# EAGLE design board (EAGLE 9.3.0)
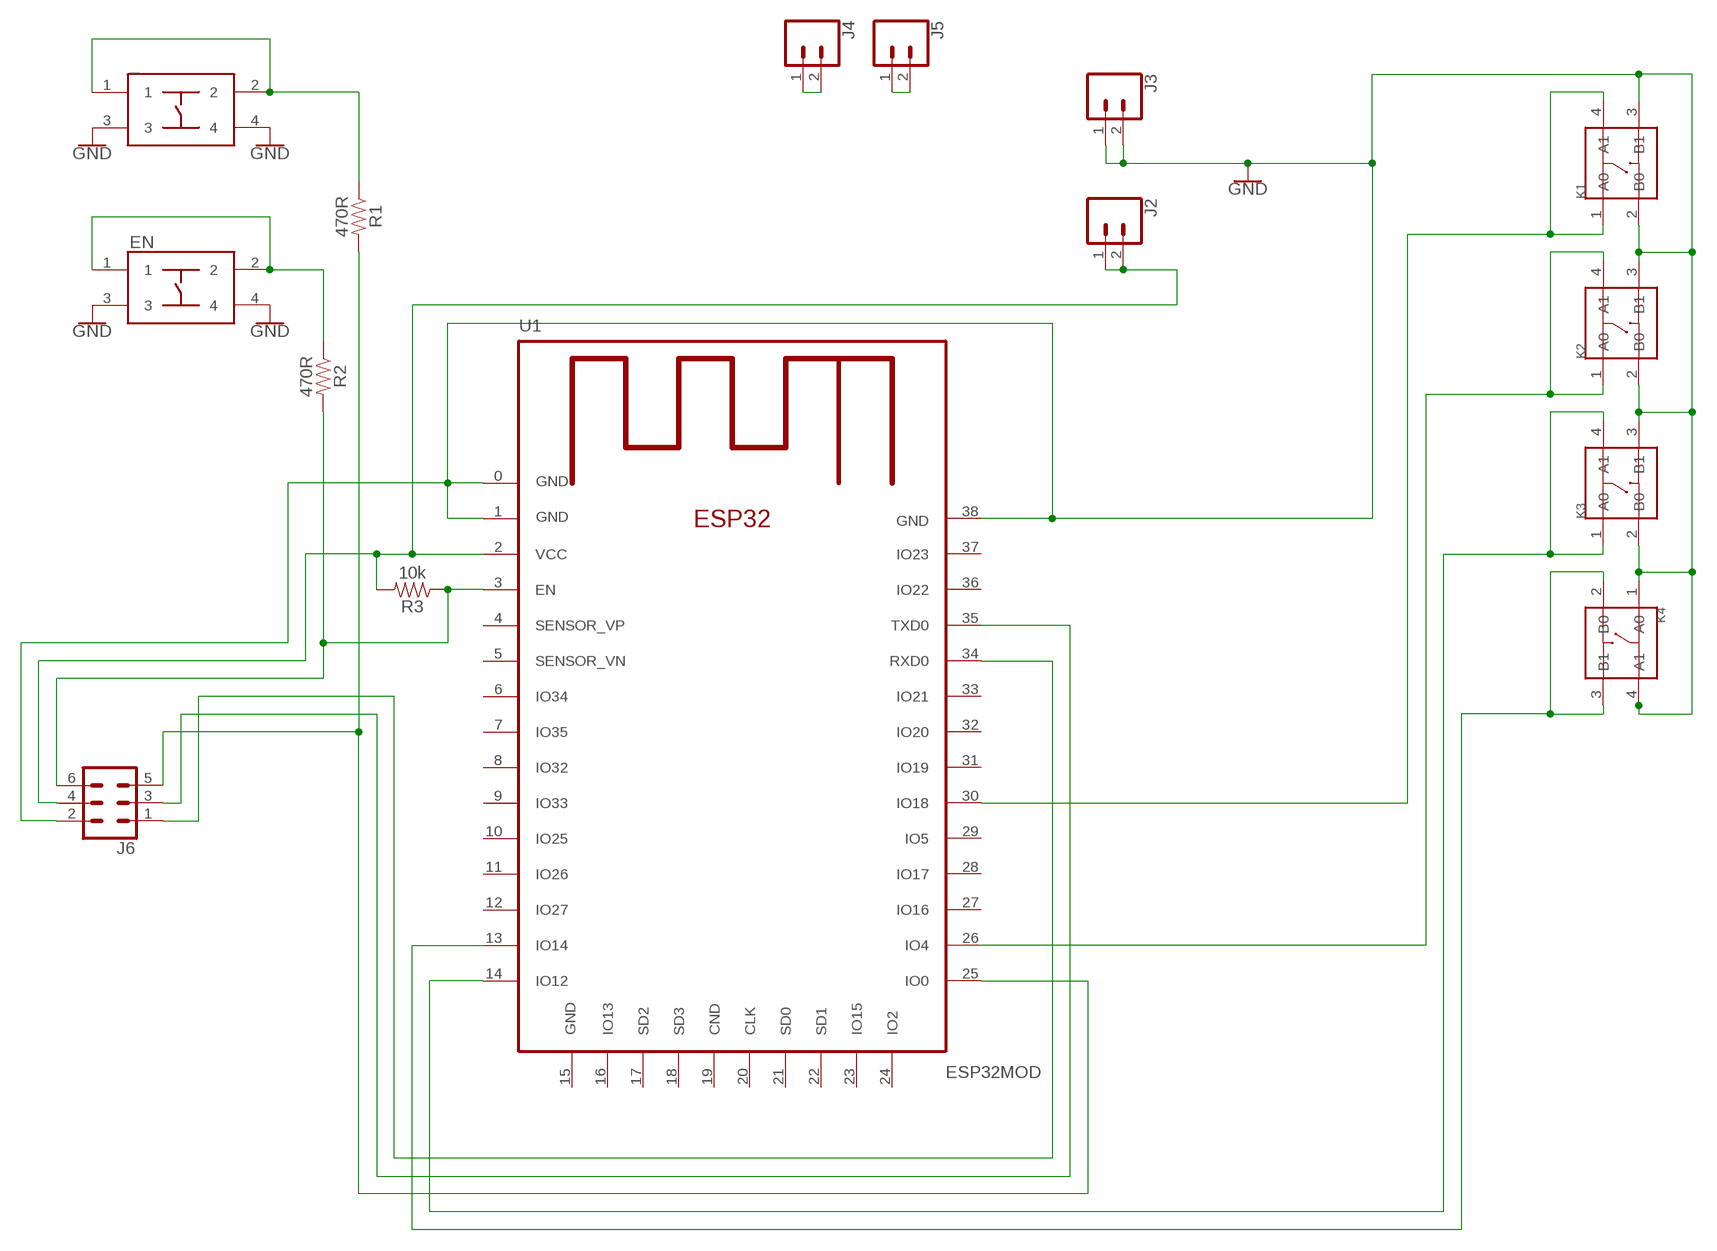
[diagram p0: schematic, sheet 1]

## Parts
_  TACTILE_SWITCH_DEV  [TACTEIL_SWITCH_PAC]
EN  TACTILE_SWITCH_DEV  [TACTEIL_SWITCH_PAC]
J2  CONN_02  [1X02]
J3  CONN_02  [1X02]
J4  CONN_02  [1X02]
J5  CONN_02  [1X02]
J6  CONN_03X2FEMALE_SMD  [2X3_SMD]
K1  SMD-SWITCH-TACTILE-SPST-NO(4P-D6.0MM)  [SW4-SMD-6.0X6.0X5.0MM]
K2  SMD-SWITCH-TACTILE-SPST-NO(4P-D6.0MM)  [SW4-SMD-6.0X6.0X5.0MM]
K3  SMD-SWITCH-TACTILE-SPST-NO(4P-D6.0MM)  [SW4-SMD-6.0X6.0X5.0MM]
K4  SMD-SWITCH-TACTILE-SPST-NO(4P-D6.0MM)  [SW4-SMD-6.0X6.0X5.0MM]
R1  470R  1KOHM-0603-1/10W-1%  [0603]
R2  470R  1KOHM-0603-1/10W-1%  [0603]
R3  10k  1KOHM-0603-1/10W-1%  [0603]
U1  ESP32MOD  [ESP32MOD]

## Nets
GND: _.3 _.4 EN.3 EN.4 J3.1 J3.2 J6.2 K1.2(B0) K1.3(B1) K2.2(B0) K2.3(B1) K3.2(B0) K3.3(B1) K4.1(A0) K4.4(A1) U1.0(GND) U1.1(GND) U1.38(GND)
N$1: _.1 _.2 R1.1
N$2: J6.6 R2.2 R3.1 U1.3(EN)
N$4: J2.1 J2.2 J6.4 R3.2 U1.2(VCC)
N$7: EN.1 EN.2 R2.1
N$9: J4.1 J4.2
N$10: J6.5 R1.2 U1.25(IO0)
N$11: K2.1(A0) K2.4(A1) U1.26(IO4)
N$12: K3.1(A0) K3.4(A1) U1.14(IO12)
N$13: K4.2(B0) K4.3(B1) U1.13(IO14)
N$14: J5.1 J5.2
N$15: K1.1(A0) K1.4(A1) U1.30(IO18)
N$16: J6.3 U1.35(TXD0)
N$17: J6.1 U1.34(RXD0)
Unconnected: U1.4(SENSOR_VP) U1.5(SENSOR_VN) U1.6(IO34) U1.7(IO35) U1.8(IO32) U1.9(IO33) U1.10(IO25) U1.11(IO26) U1.12(IO27) U1.16(IO13) U1.17(SD2) U1.18(SD3) U1.19(CND) U1.20(CLK) U1.21(SD0) U1.22(SD1) U1.23(IO15) U1.24(IO2) U1.27(IO16) U1.28(IO17) U1.29(IO5) U1.31(IO19) U1.32(IO20) U1.33(IO21) U1.36(IO22) U1.37(IO23)

## Power pins joined to a net without a drawn wire
GND: U1.15(GND)

## Library data of the parts
_ EN = Tactaile:TACTILE_SWITCH_DEV
J2-J5 = SparkFun-Connectors:CONN_02: Multi connection point. Often used as Generic Header-pin footprint for 0.1 inch spaced/style header connections On any of the 0.1 inch spaced packages, you can populate with these: Break Away Headers - Straight <https://www.sparkfun.com/products/116> (PRT-00116) Break Away Male Headers - Right Angle <https://www.sparkfun.com/products/553> (PRT-00553) Female Headers <https://www.sparkfun.com/products/115> (PRT-00115) Break Away Headers - Machine Pin <https://www.sparkfun.com/products/117> (PRT-00117) Break Away Female Headers - Swiss Machine Pin <https://www.sparkfun.com/products/743> (PRT-00743) For SCREWTERMINALS and SPRING TERMINALS visit here: Screw Terimnals on SparkFun.com <https://www.sparkfun.com/search/results?term=Screw+Terminals> (5mm/3.5mm/2.54mm spacing) This device is also useful as a general connection point to wire up your design to another part of your project. Our various solder wires solder well into these plated through hole pads. Hook-Up Wire - Assortment (Stranded, 22 AWG) <https://www.sparkfun.com/products/11375> (PRT-11375) Hook-Up Wire - Assortment (Solid Core, 22 AWG) <https://www.sparkfun.com/products/11367> (PRT-11367) View the entire wire category on our website here <https://www.sparkfun.com/categories/141> Special notes: Molex polarized connector foot print use with: PRT-08233 with associated crimp pins and housings. 2.54_SCREWTERM for use with PRT-10571. 3.5mm Screw Terminal footprints for PRT-08084 5mm Screw Terminal footprints for use with PRT-08432
J6 = SparkFun-Connectors:CONN_03X2: Multi connection point. Often used as Generic Header-pin footprint for 0.1 inch spaced/style header connections You can populate with any combo of single row headers, but if you'd like an exact match, check these: Header - 2x3 (Male, 0.1") <https://www.sparkfun.com/products/12807> (PRT-12807) Header - 2x3 (Female, 0.1") <https://www.sparkfun.com/products/13010> (PRT-13010) 2x3 Pin Shrouded Header <https://www.sparkfun.com/products/10877> (PRT-10877) On any of the 0.1 inch spaced packages, you can populate with these: Break Away Headers - Straight <https://www.sparkfun.com/products/116> (PRT-00116) Break Away Male Headers - Right Angle <https://www.sparkfun.com/products/553> (PRT-00553) Female Headers <https://www.sparkfun.com/products/115> (PRT-00115) Break Away Headers - Machine Pin <https://www.sparkfun.com/products/117> (PRT-00117) Break Away Female Headers - Swiss Machine Pin <https://www.sparkfun.com/products/743> (PRT-00743) Special note: the shrouded connector mates well with our 3x2 ribbon cables: Ribbon Crimp Connector - 6-pin (2x3, Female) <https://www.sparkfun.com/products/10651> (PRT-10651) Ribbon Cable - 6 wire (15ft) <https://www.sparkfun.com/products/10646> (PRT-10646); PROD_ID: CONN-11290
K1-K4 = Seeed-Switch:SMD-SWITCH-TACTILE-SPST-NO(4P-D6.0MM): 311020004; MPN: DTSM-62K-S-V-T/R(SN431)
R1-R3 = SparkFun-Resistors:1KOHM: 1kΩ resistor A resistor is a passive two-terminal electrical component that implements electrical resistance as a circuit element. Resistors act to reduce current flow, and, at the same time, act to lower voltage levels within circuits. - Wikipedia; PROD_ID: RES-07856; VALUE: 1k
U1 = ESP3x:ESP32MOD: ESP32 Module Espressif

## Board
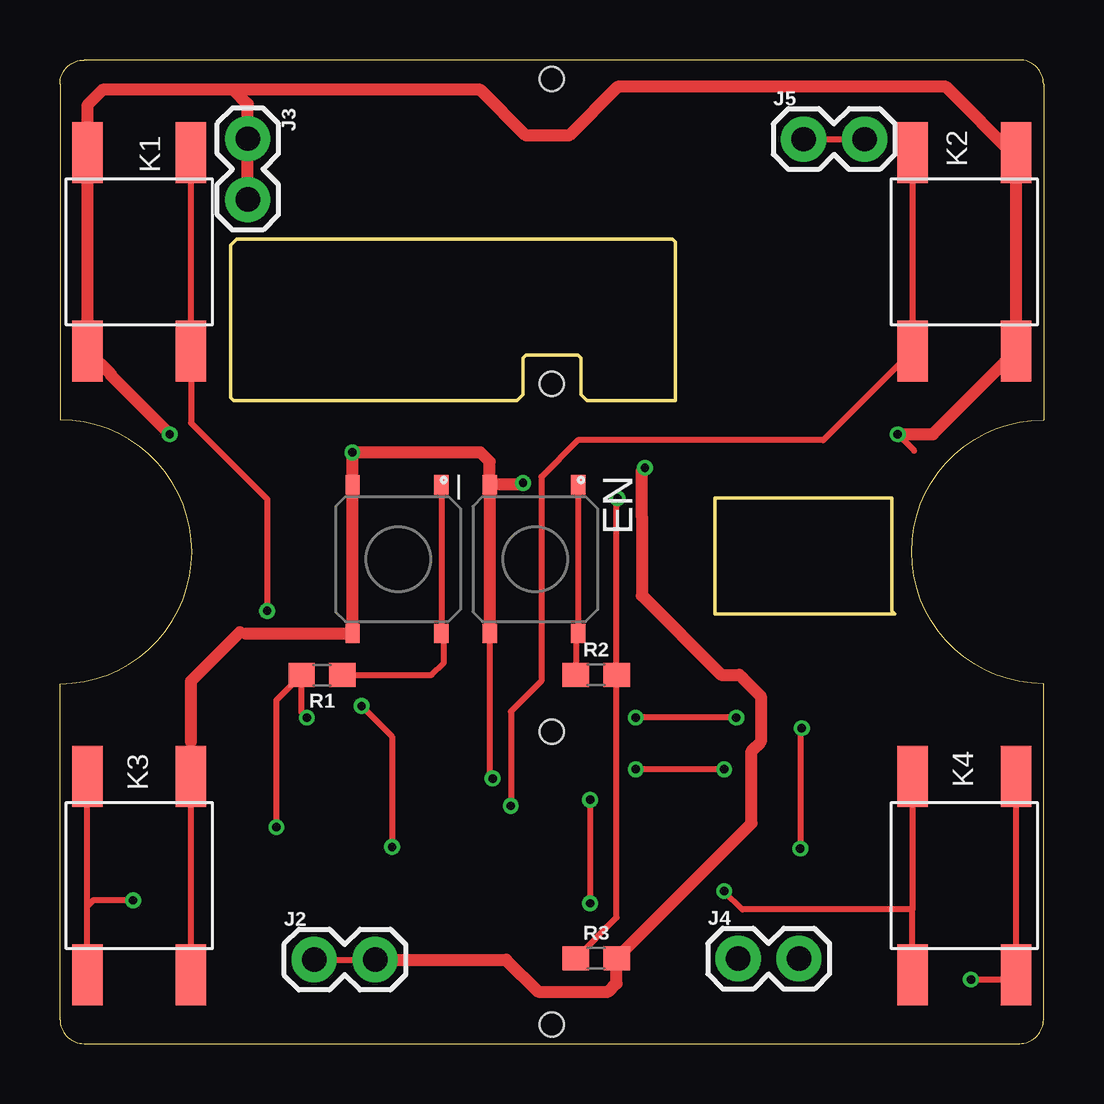
[diagram p1: board, top side]
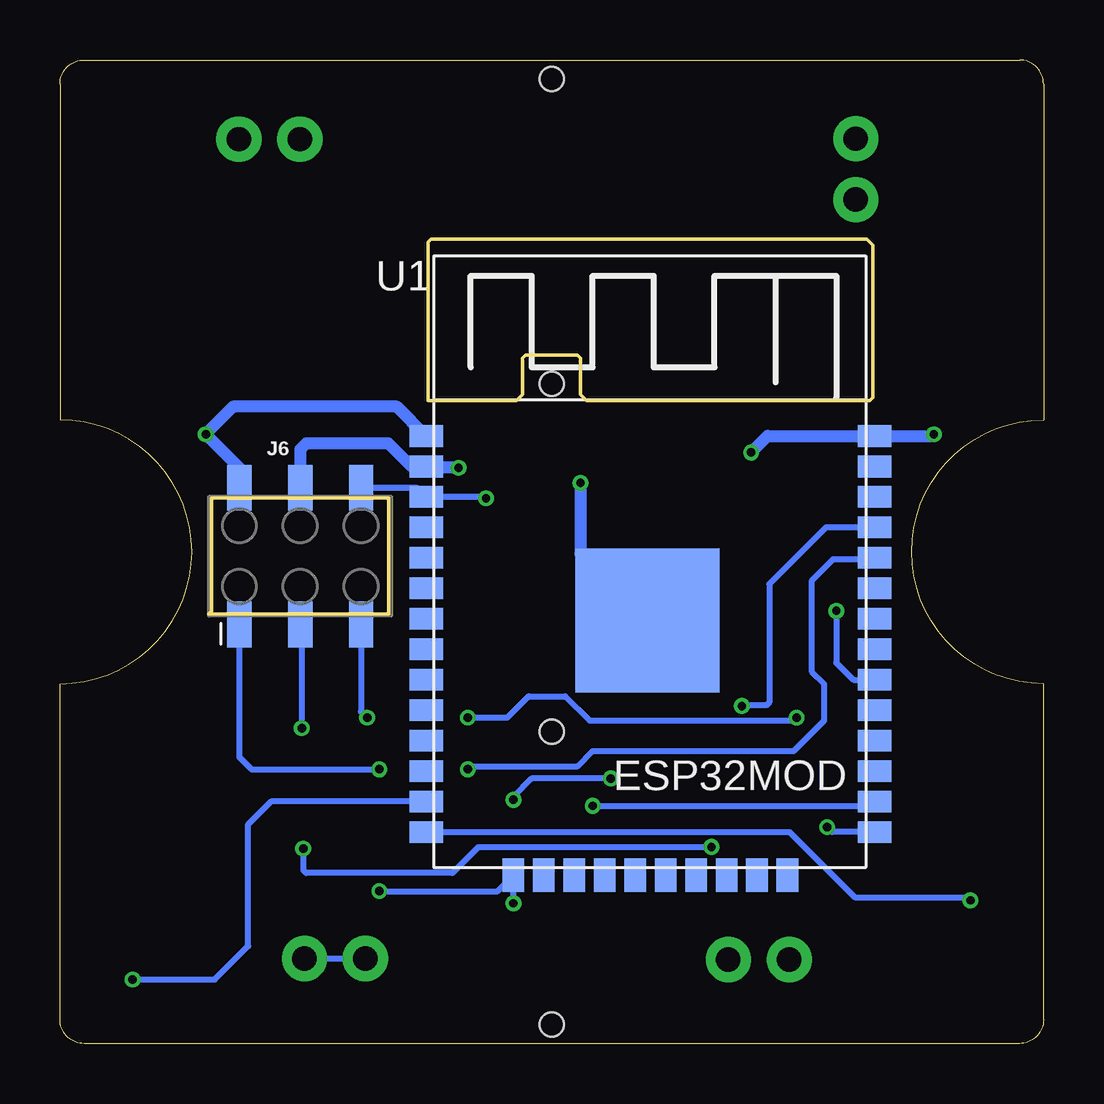
[diagram p2: board, bottom side, seen from below]

Size 41 x 41 mm. Coordinates in mm from the lower left corner, seen from the top.
Outline: 1,0 40,0 arc90 41,1 41,15 arc-90 35.5,20.5 arc-90 41,26 41,40 arc90 40,41 1,41 arc90 0,40 0,26 arc-90 5.5,20.5 arc-90 0,15 0,1 arc90 1,0
Copper layers (1*16): Top 0.035mm / dielectric 1.5mm / Bottom 0.035mm
Design rules "Itead": minimum track width 6mil, minimum drill 12mil, track to track 6mil, track to pad 6mil, pad to pad 6mil, via to via 6mil, smd to smd 0mil, copper to edge 10mil, drill to drill 10mil, minimum pad ring 10mil, minimum via ring 6mil, stop-mask expansion 2mil, vias tented up to drill 100mil, thermal gap 10mil
Holes 1 mm at 20.5,27.5 20.5,0.8 20.5,13 20.5,40.2
Milling: 20 lines

### Footprints (pad centres in the part's own frame; a part is rotated, then mirrored left to right if it is on the bottom)
TACTEIL_SWITCH_PAC = smd 0.8 x 0.6: 1 -3.1,1.8; 2 3.1,1.8; 3 -3.1,-1.9; 4 3.1,-1.9
1X02 = drill 1.016 pad 1.88: 1 0,0; 2 2.54,0
2X3_SMD = smd 1.02 x 1.9: 1 -2.54,-2.85; 2 -2.54,2.85; 3 0,-2.85; 4 0,2.85; 5 2.54,-2.85; 6 2.54,2.85
SW4-SMD-6.0X6.0X5.0MM = smd 2.54 x 1.27: 1 -4.129,2.159; 2 -4.129,-2.159; 3 4.129,-2.159; 4 4.129,2.159
0603 = smd 1.1 x 1: 1 -0.85,0; 2 0.85,0
ESP32MOD = smd 6 x 6: 0 9.9,12.3 | smd 1.4 x 0.9: 1 0.68,19.99; 2 0.68,18.72; 3 0.68,17.45; 4 0.68,16.18; 5 0.68,14.91; 6 0.68,13.64; 7 0.68,12.37; 8 0.68,11.1; 9 0.68,9.83; 10 0.68,8.56; 11 0.68,7.29; 12 0.68,6.02; 13 0.68,4.75; 14 0.68,3.48; 25 19.38,3.48; 26 19.38,4.75; 27 19.38,6.02; 28 19.38,7.29; 29 19.38,8.56; 30 19.38,9.83; 31 19.38,11.1; 32 19.38,12.37; 33 19.38,13.64; 34 19.38,14.91; 35 19.38,16.18; 36 19.38,17.45; 37 19.38,18.72; 38 19.38,19.99 | smd 0.9 x 1.4: 15 4.31,1.68; 16 5.58,1.68; 17 6.85,1.68; 18 8.12,1.68; 19 9.39,1.68; 20 10.66,1.68; 21 11.93,1.68; 22 13.2,1.68; 23 14.47,1.68; 24 15.74,1.68

### Placement (x,y rotation side)
_  14.1,20.19 270 top
EN  19.81,20.19 270 top
J2  10.6,3.5 0 top
J3  7.83,37.72 270 top
J4  28.27,3.54 0 top
J5  31,37.7 0 top
J6  30.99,20.32 0 bottom
K1  3.3,33 270 top
K2  37.7,33 90 top
K3  3.3,7 90 top
K4  37.7,7 90 top
R1  10.92,15.37 180 top
R2  22.35,15.37 0 top
R3  22.35,3.56 0 top
U1  26.42,5.33 0 bottom

### Tracks (layer width: path | path; a pad name or v marks a point on that pad's centre or on a via)
GND  (via drill 0.35)
  Top 0.254: K2.3 39.86,36.96 | 39.85,28.86 K2.2 | K4.1 35.54,5.59 | K3.2 K3.3 5.46,12.57 | 7.49,17.14 7.54,17.09 7.75,17.09 | 1.14,37.34 K1.2 | 7.24,39.75 7.87,39.12 7.83,39.07 7.83,37.97 J3.1 J3.2 | 35.61,24.71 v34.92,25.4 | 1.23,28.79 K1.3 | EN.4 17.91,17.02 17.91,11.05 v18.03,11.05 | v22.1,10.16 v22.1,5.84 | K4.4 35.54,5.59 | 35.54,5.59 28.45,5.59 v27.69,6.35
  Top 0.508: J3.2 7.83,37.97 | J3.1 7.83,39.16 7.24,39.75 | 7.24,39.75 1.78,39.75 1.14,39.11 1.14,37.34 | K1.2 K1.3 | v34.92,25.4 36.39,25.4 39.85,28.86 | K2.2 39.86,36.96 36.94,39.88 23.24,39.88 21.21,37.85 19.43,37.85 17.53,39.75 7.24,39.75 | v4.57,25.4 2.12,27.86 2.12,27.9 1.23,28.79 | 5.46,12.57 5.46,15.11 7.49,17.14 | 7.75,17.09 _.4 _.3 v12.2,24.63 v12.19,24.64 17.53,24.64 17.91,24.25 EN.3 | EN.3 17.91,17.02 | v19.3,23.37 19.23,23.29 EN.3
  Bottom 0.254: 33.53,23.62 J6.2 | v18.03,11.05 21.34,11.05 22.1,10.29 v22.1,10.16 | v22.1,5.84 22.1,7.01 | 22.1,7.01 U1.15 | v27.69,6.35 22.75,6.35 22.1,7.01
  Bottom 0.508: v4.57,25.4 4.65,25.32 U1.38 11.51,25.32 v12.19,24.64 | v19.3,23.37 19.3,20.42 U1.0 | J6.2 33.53,24 v34.92,25.4 33.78,26.54 26.95,26.54 U1.1
N$1
  Top 0.254: _.1 _.2 16,16.99 16,15.88 15.49,15.37 R1.1
N$2  (via drill 0.35)
  Top 0.254: v23.24,22.73 23.24,22.48 23.2,22.44 R2.2 23.2,5.26 R3.1
  Bottom 0.254: J6.6 26.12,23.17 U1.3 23.29,22.78 v23.24,22.73
N$4  (via drill 0.35)
  Top 0.254: J2.1 J2.2 | 28.32,15.37 28.45,15.24 | 24.26,21.97 24.26,22.1
  Top 0.508: J2.2 18.6,3.5 19.94,2.16 22.86,2.16 23.2,2.5 R3.2 28.83,9.18 28.83,12.19 29.21,12.57 29.21,14.48 28.45,15.24 | 24.26,21.97 24.26,18.67 27.56,15.37 28.32,15.37 | 24.26,22.1 24.26,23.88 v24.38,24
  Bottom 0.254: J6.4 30.86,23.3 | U1.2 25.79,24 25.15,24
  Bottom 0.508: v24.38,24 25.15,24 | U1.2 26.34,24.05 27.3,25.02 30.73,25.02 30.99,24.77 J6.4
N$7
  Top 0.254: EN.1 EN.2 21.5,16.98 R2.1
N$9
  Bottom 0.254: J4.1 J4.2
N$10  (via drill 0.35)
  Top 0.254: v9.02,9.02 9.02,14.31 R1.2 10.07,13.8 v10.29,13.59 | v28.19,13.59 v24,13.59
  Bottom 0.254: U1.25 8.81,8.81 v9.02,9.02 | J6.5 28.45,13.84 v28.19,13.59 | v24,13.59 22.35,13.59 21.46,14.48 19.94,14.48 18.92,13.46 10.41,13.46 v10.29,13.59
N$11  (via drill 0.35)
  Top 0.254: K2.4 K2.1 31.82,25.15 21.59,25.15 20.07,23.62 20.07,15.11 18.8,13.84 v18.8,9.91
  Bottom 0.254: v18.8,9.91 7.21,9.91 U1.26
N$12  (via drill 0.35)
  Top 0.254: K3.1 1.14,5.71 | 1.14,5.71 K3.4 | v3.05,5.97 1.4,5.97 1.14,5.71
  Bottom 0.254: U1.14 10.59,8.81 7.87,6.1 2.92,6.1 v3.05,5.97
N$13  (via drill 0.35)
  Top 0.254: K4.3 K4.2 39.66,2.67 v37.97,2.67
  Bottom 0.254: U1.13 32.21,10.08 33.15,9.14 33.15,4.06 34.54,2.67 v37.97,2.67
N$14
  Top 0.254: J5.1 J5.2
N$15  (via drill 0.35)
  Top 0.254: K1.1 K1.4 5.46,25.87 8.64,22.69 v8.64,18.03
  Bottom 0.254: v8.64,18.03 8.64,15.88 7.92,15.16 U1.30
N$16  (via drill 0.35)
  Top 0.254: v12.57,14.07 13.84,12.8 v13.84,8.19 | v30.92,13.14 30.86,13.08 v30.86,8.13
  Bottom 0.254: U1.35 9.07,21.51 11.43,19.15 11.43,14.22 11.56,14.1 12.54,14.1 v12.57,14.07 | J6.3 30.92,17.41 v30.92,13.14 | v30.86,8.13 30.86,7.24 30.73,7.11 24.64,7.11 23.56,8.19 v13.84,8.19
N$17  (via drill 0.35)
  Top 0.254: v27.69,11.43 v24,11.43
  Bottom 0.254: J6.1 33.53,11.94 33.02,11.43 v27.69,11.43 | v24,11.43 23.88,11.56 19.43,11.56 18.8,12.19 10.41,12.19 9.14,13.46 9.14,14.99 9.65,15.49 9.65,19.3 8.76,20.19 7.09,20.19 U1.34

### Text on the board
tValues: EN